# EAGLE schematic untitled (EAGLE 6.4)
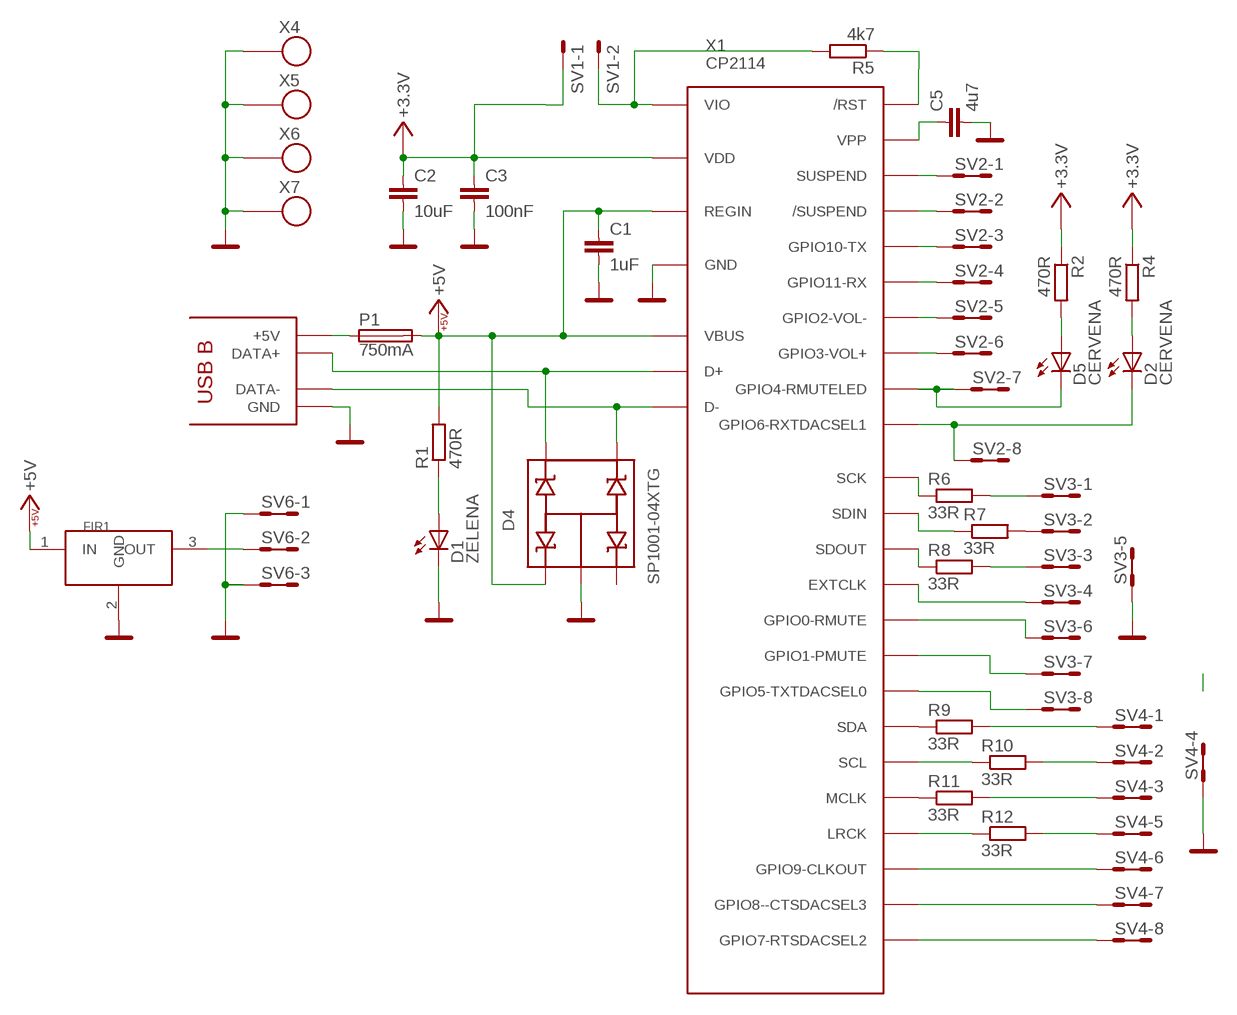
[diagram p0: schematic, sheet 1]

## Parts
C1  1uF  C0805  [C0805]
C2  10uF  C0805  [C0805]
C3  100nF  C0805  [C0805]
C5  4u7  C0805  [C0805]
D1  ZELENA  LED1206_2  [1206_2]
D2  CERVENA  LED1206_2  [1206_2]
D4  SP1001-04XTG  CP2112  [SOT553]
D5  CERVENA  LED1206_2  [1206_2]
FIR1  FILTR0805  [F0805]
P1  750mA  POJISTKA_1812  [1812]
R1  470R  R0805  [0805]
R2  470R  R0805  [0805]
R4  470R  R0805  [0805]
R5  4k7  R0805  [0805]
R6  33R  R0805  [0805]
R7  33R  R0805  [0805]
R8  33R  R0805  [0805]
R9  33R  R0805  [0805]
R10  33R  R0805  [0805]
R11  33R  R0805  [0805]
R12  33R  R0805  [0805]
SV1  MA02-1  [MA02-1]
SV2  MA08-2  [MA08-2]
SV3  MA08-2  [MA08-2]
SV4  MA08-2  [MA08-2]
SV6  MA03-2  [MA03-2]
X1  CP2114  [QFN-32]
X3  USB_B  [USB_B]
X4  SROUB3M  [SROUB3M]
X5  SROUB3M  [SROUB3M]
X6  SROUB3M  [SROUB3M]
X7  SROUB3M  [SROUB3M]

## Nets
+3.3V: C2.1 C3.1 R2.1 R4.1 SV1.1 X1.7(VDD)
+5V: C1.1 D4.1 FIR1.1(IN) P1.2 R1.2 X1.8(REGIN) X1.9(VBUS)
GND: C1.2 C2.2 C3.2 C5.2 D1.K(C) D4.2 FIR1.2(GND) SV3.9 SV3.10 SV4.7 SV4.8 SV6.1 SV6.2 SV6.5 SV6.6 X1.3(GND) X1.EXP(GND) X3.4(GND) X3.GND X3.GND2(GND) X4.P$1 X5.P$1 X6.P$1 X7.P$1
N$1: D4.5 X1.4(D+) X3.3(DATA+)
N$2: D4.4 X1.5(D-) X3.2(DATA-)
N$3: FIR1.3(OUT) SV6.3 SV6.4
N$4: C5.1 X1.21(VPP)
N$5: P1.1 X3.1(+5V)
N$6: D1.A R1.1
N$7: R5.2 SV1.2 X1.6(VIO)
N$11: D5.A R2.2
N$13: D2.A R4.2
N$14: SV2.1 SV2.2 X1.18(SUSPEND)
N$15: R5.1 X1.10(/RST)
N$16: SV4.11 SV4.12 X1.22(GPIO9-CLKOUT)
N$17: SV2.3 SV2.4 X1.17(/SUSPEND)
N$18: SV2.5 SV2.6 X1.16(GPIO10-TX)
N$19: SV2.7 SV2.8 X1.15(GPIO11-RX)
N$20: SV2.9 SV2.10 X1.14(GPIO2-VOL-)
N$21: SV2.11 SV2.12 X1.13(GPIO3-VOL+)
N$22: D5.K(C) SV2.13 SV2.14 X1.12(GPIO4-RMUTELED)
N$23: D2.K(C) SV2.15 SV2.16 X1.11(GPIO6-RXTDACSEL1)
N$24: R6.2 SV3.1 SV3.2
N$25: R7.2 SV3.3 SV3.4
N$26: R8.2 SV3.5 SV3.6
N$27: SV3.15 SV3.16 X1.28(GPIO5-TXTDACSEL0)
N$28: SV3.13 SV3.14 X1.29(GPIO1-PMUTE)
N$29: SV3.11 SV3.12 X1.30(GPIO0-RMUTE)
N$30: SV3.7 SV3.8 X1.31(EXTCLK)
N$31: R8.1 X1.32(SDOUT)
N$32: R7.1 X1.1(SDIN)
N$33: R6.1 X1.2(SCK)
N$34: R9.1 X1.27(SDA)
N$35: R10.1 X1.26(SCL)
N$36: R11.1 X1.25(MCLK)
N$37: R12.1 X1.23(LRCK)
N$38: SV4.13 SV4.14 X1.20(GPIO8--CTSDACSEL3)
N$39: SV4.15 SV4.16 X1.19(GPIO7-RTSDACSEL2)
N$40: R9.2 SV4.1 SV4.2
N$41: R10.2 SV4.3 SV4.4
N$42: R11.2 SV4.5 SV4.6
N$43: R12.2 SV4.9 SV4.10
Unconnected: D4.3

## Library data of the parts
C1-C3 C5 = moje_C:C0805
D1 D2 D5 = moje_diody:LED1206_2
D4 = moje_diody:CP2112: SP1001-04XTG
FIR1 = moje:FILTR0805
P1 = moje:POJISTKA_1812: Pojistka s pouzdrem 1812
R1 R2 R4-R12 = moje_R:R0805
SV1 = moje_hrebinky:MA02-1
SV2-SV4 = moje_hrebinky:MA08-2: PIN HEADER; OC_FARNELL: unknown; OC_NEWARK: unknown
SV6 = moje_hrebinky:MA03-2: PIN HEADER; OC_FARNELL: unknown; OC_NEWARK: unknown
X1 = moje_io:CP2114
X3 = moje_konektory:USB_B
X4-X7 = moje:SROUB3M